# Altium schematic sheet 02_connector.SchDoc
size A3
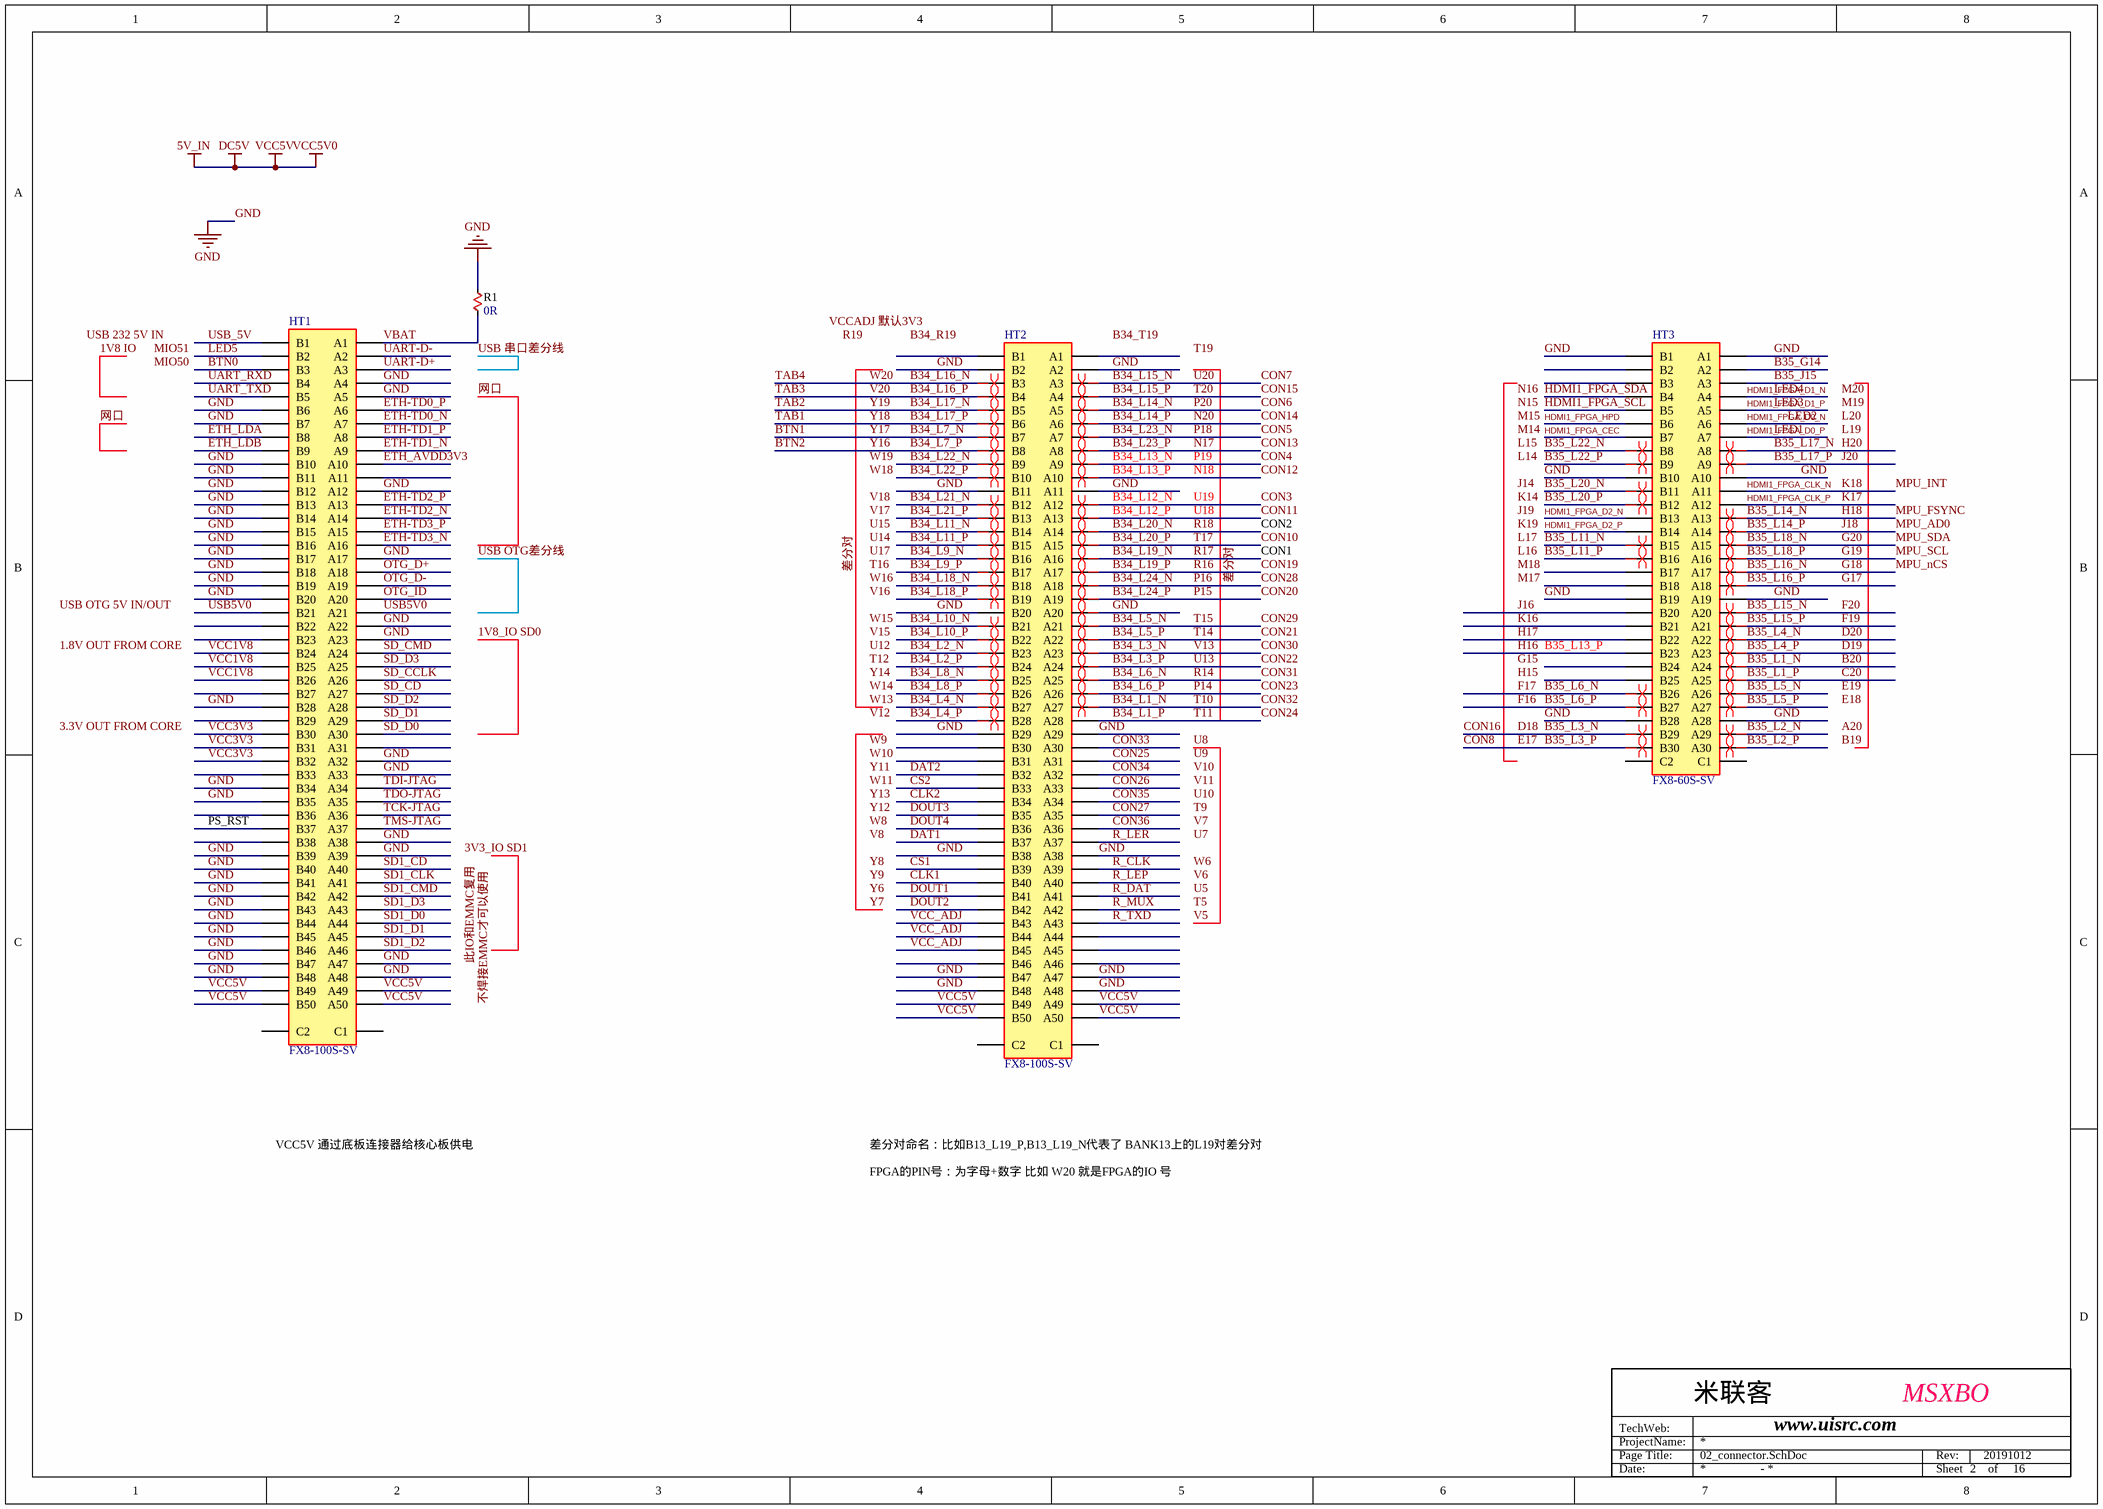
[diagram p0: 02_connector.SchDoc]

## Parts
HT1  FX8-100S-SV  [FX8-100S-SV92]
HT2  FX8-100S-SV  [FX8-100S-SV92]
HT3  FX8-60S-SV  [FX8-60S-SV92]
R1  0R  [R0603]

## Nets
GND: HT1.A4 HT1.A5 HT1.A12 HT1.A17 HT1.A22 HT1.A23 HT1.A32 HT1.A33 HT1.A38 HT1.A39 HT1.A47 HT1.A48 HT1.B6 HT1.B7 HT1.B10 HT1.B11 HT1.B12 HT1.B13 HT1.B14 HT1.B15 HT1.B16 HT1.B17 HT1.B18 HT1.B19 HT1.B20 HT1.B28 HT1.B34 HT1.B35 HT1.B39 HT1.B40 HT1.B41 HT1.B42 HT1.B43 HT1.B44 HT1.B45 HT1.B46 HT1.B47 HT1.B48 HT2.A2 HT2.A11 HT2.A20 HT2.A29 HT2.A38 HT2.A47 HT2.A48 HT2.B2 HT2.B11 HT2.B20 HT2.B29 HT2.B38 HT2.B47 HT2.B48 HT3.A1 HT3.A10 HT3.A19 HT3.A28 HT3.B1 HT3.B10 HT3.B19 HT3.B28 R1.1
VCC5V: HT1.A49 HT1.A50 HT1.B49 HT1.B50 HT2.A49 HT2.A50 HT2.B49 HT2.B50  [also labelled 5V_IN, DC5V, VCC5V0]
B20: HT3.A24  [also labelled B35_L1_N]
B34_L1_N: HT2.A27  [also labelled CON32, T10]
B34_L1_P: HT2.A28  [also labelled CON24, T11]
B34_L2_N: HT2.B23
B34_L2_P: HT2.B24
B34_L3_N: HT2.A23  [also labelled CON30, V13]
B34_L3_P: HT2.A24  [also labelled CON22, U13]
B34_L4_N: HT2.B27
B34_L4_P: HT2.B28
B34_L5_N: HT2.A21  [also labelled CON29, T15]
B34_L5_P: HT2.A22  [also labelled CON21, T14]
B34_L6_N: HT2.A25  [also labelled CON31, R14]
B34_L6_P: HT2.A26  [also labelled CON23, P14]
B34_L7_N: HT2.B7  [also labelled BTN1, Y17]
B34_L7_P: HT2.B8  [also labelled BTN2, Y16]
B34_L8_N: HT2.B25
B34_L8_P: HT2.B26
B34_L9_N: HT2.B16
B34_L9_P: HT2.B17
B34_L10_N: HT2.B21
B34_L10_P: HT2.B22
B34_L11_N: HT2.B14
B34_L11_P: HT2.B15
B34_L12_N: HT2.A12  [also labelled CON3, U19]
B34_L12_P: HT2.A13  [also labelled CON11, U18]
B34_L13_N: HT2.A9  [also labelled CON4, P19]
B34_L13_P: HT2.A10  [also labelled CON12, N18]
B34_L14_N: HT2.A5  [also labelled CON6, P20]
B34_L14_P: HT2.A6  [also labelled CON14, N20]
B34_L15_N: HT2.A3  [also labelled CON7, U20]
B34_L15_P: HT2.A4  [also labelled CON15, T20]
B34_L16_N: HT2.B3  [also labelled TAB4, W20]
B34_L16_P: HT2.B4  [also labelled TAB3, V20]
B34_L17_N: HT2.B5  [also labelled TAB2, Y19]
B34_L17_P: HT2.B6  [also labelled TAB1, Y18]
B34_L18_N: HT2.B18
B34_L18_P: HT2.B19
B34_L19_N: HT2.A16  [also labelled CON1, R17]
B34_L19_P: HT2.A17  [also labelled CON19, R16]
B34_L20_N: HT2.A14  [also labelled CON2, R18]
B34_L20_P: HT2.A15  [also labelled CON10, T17, 差分对]
B34_L21_N: HT2.B12
B34_L21_P: HT2.B13
B34_L22_N: HT2.B9
B34_L22_P: HT2.B10
B34_L23_N: HT2.A7  [also labelled CON5, P18]
B34_L23_P: HT2.A8  [also labelled CON13, N17]
B34_L24_N: HT2.A18  [also labelled CON28, P16]
B34_L24_P: HT2.A19  [also labelled CON20, P15]
B35_G14: HT3.A2
B35_J15: HT3.A3
B35_L1_P: HT3.A25  [also labelled C20]
B35_L2_N: HT3.A29
B35_L2_P: HT3.A30
B35_L3_N: HT3.B29  [also labelled CON16, D18]
B35_L3_P: HT3.B30  [also labelled CON8, E17]
B35_L4_N: HT3.A22  [also labelled D20]
B35_L4_P: HT3.A23  [also labelled D19]
B35_L5_N: HT3.A26
B35_L5_P: HT3.A27
B35_L6_N: HT3.B26  [also labelled F17]
B35_L6_P: HT3.B27  [also labelled F16]
B35_L11_N: HT3.B15
B35_L11_P: HT3.B16
B35_L13_P: HT3.B23  [also labelled H16]
B35_L14_N: HT3.A13  [also labelled H18, MPU_FSYNC]
B35_L14_P: HT3.A14  [also labelled J18, MPU_AD0]
B35_L15_N: HT3.A20  [also labelled F20]
B35_L15_P: HT3.A21  [also labelled F19]
B35_L16_N: HT3.A17  [also labelled G18, MPU_nCS]
B35_L16_P: HT3.A18  [also labelled G17]
B35_L17_N: HT3.A8  [also labelled H20]
B35_L17_P: HT3.A9  [also labelled J20]
B35_L18_N: HT3.A15  [also labelled G20, MPU_SDA]
B35_L18_P: HT3.A16  [also labelled G19, MPU_SCL]
B35_L20_N: HT3.B11
B35_L20_P: HT3.B12
B35_L22_N: HT3.B8
B35_L22_P: HT3.B9
BTN0: HT1.B3
CLK1: HT2.B40
CLK2: HT2.B34
CON25: HT2.A31
CON26: HT2.A33
CON27: HT2.A35
CON33: HT2.A30
CON34: HT2.A32
CON35: HT2.A34
CON36: HT2.A36
CS1: HT2.B39
CS2: HT2.B33
DAT1: HT2.B37
DAT2: HT2.B32
DOUT1: HT2.B41
DOUT2: HT2.B42
DOUT3: HT2.B35
DOUT4: HT2.B36
ETH-TD0_N: HT1.A7
ETH-TD0_P: HT1.A6
ETH-TD1_N: HT1.A9
ETH-TD1_P: HT1.A8
ETH-TD2_N: HT1.A14
ETH-TD2_P: HT1.A13
ETH-TD3_N: HT1.A16
ETH-TD3_P: HT1.A15
ETH_AVDD3V3: HT1.A10
ETH_LDA: HT1.B8
ETH_LDB: HT1.B9
H17: HT3.B22
HDMI1_FPGA_CEC: HT3.B7
HDMI1_FPGA_CLK_N: HT3.A11  [also labelled K18, MPU_INT]
HDMI1_FPGA_CLK_P: HT3.A12  [also labelled K17]
HDMI1_FPGA_D0_N: HT3.A6  [also labelled LED2]
HDMI1_FPGA_D0_P: HT3.A7  [also labelled LED1]
HDMI1_FPGA_D1_N: HT3.A4  [also labelled LED4]
HDMI1_FPGA_D1_P: HT3.A5  [also labelled LED3]
HDMI1_FPGA_D2_N: HT3.B13
HDMI1_FPGA_D2_P: HT3.B14
HDMI1_FPGA_HPD: HT3.B6
HDMI1_FPGA_SCL: HT3.B5
HDMI1_FPGA_SDA: HT3.B4
J16: HT3.B20
K16: HT3.B21
LED5: HT1.B2
OTG_D+: HT1.A18
OTG_D-: HT1.A19
OTG_ID: HT1.A20
PS_RST: HT1.B37
R_CLK: HT2.A39
R_DAT: HT2.A41
R_LEP: HT2.A40
R_LER: HT2.A37
R_MUX: HT2.A42
R_TXD: HT2.A43
SD1_CD: HT1.A40
SD1_CLK: HT1.A41
SD1_CMD: HT1.A42
SD1_D0: HT1.A44
SD1_D1: HT1.A45
SD1_D2: HT1.A46
SD1_D3: HT1.A43
SD_CCLK: HT1.A26
SD_CD: HT1.A27
SD_CMD: HT1.A24
SD_D0: HT1.A30
SD_D1: HT1.A29
SD_D2: HT1.A28
SD_D3: HT1.A25
TCK-JTAG: HT1.A36
TDI-JTAG: HT1.A34
TDO-JTAG: HT1.A35
TMS-JTAG: HT1.A37
UART-D+: HT1.A3
UART-D-: HT1.A2
UART_RXD: HT1.B4
UART_TXD: HT1.B5
USB5V0: HT1.A21 HT1.B21
USB_5V: HT1.B1
VBAT: HT1.A1 R1.2
VCC1V8: HT1.B24 HT1.B25 HT1.B26
VCC3V3: HT1.B30 HT1.B31 HT1.B32
VCC_ADJ: HT2.B43 HT2.B44 HT2.B45

Not connected (* = marked no-connect by the designer): HT1 A11 A31 B22 B23 B27 B29 B33 B36 B38 C1 C2; HT2 A1 A44 A45 A46 B1 B30 B31 B46 C1 C2; HT3 B2 B3 B17 B18 B24 B25 C1 C2

## Layout directives
differential pair: B20, B34_L1_N, B34_L2_N, B34_L2_P, B34_L3_N, B34_L3_P, B34_L4_N, B34_L4_P, B34_L5_N, B34_L5_P, B34_L6_N, B34_L6_P, B34_L7_N, B34_L7_P, B34_L8_N, B34_L8_P, B34_L9_N, B34_L9_P, B34_L10_N, B34_L10_P, B34_L11_N, B34_L11_P, B34_L12_N, B34_L12_P, B34_L13_N, B34_L13_P, B34_L14_N, B34_L14_P, B34_L15_N, B34_L15_P, B34_L16_N, B34_L16_P, B34_L17_N, B34_L17_P, B34_L18_N, B34_L18_P, B34_L19_N, B34_L19_P, B34_L20_N, B34_L20_P, B34_L21_N, B34_L21_P, B34_L22_N, B34_L22_P, B34_L23_N, B34_L23_P, B34_L24_N, B34_L24_P, B35_L1_P, B35_L2_N, B35_L2_P, B35_L3_N, B35_L3_P, B35_L4_N, B35_L4_P, B35_L5_N, B35_L5_P, B35_L6_N, B35_L6_P, B35_L11_N, B35_L11_P, B35_L14_N, B35_L14_P, B35_L15_N, B35_L15_P, B35_L16_N, B35_L16_P, B35_L17_N, B35_L17_P, B35_L18_N, B35_L18_P, B35_L20_N, B35_L20_P, B35_L22_N, B35_L22_P, GND

## Notes on the sheet
- VCC5V 通过底板连接器给核心板供电
- 差分对命名：比如B13_L19_P,B13_L19_N代表了 BANK13上的L19对差分对
- FPGA的PIN号：为字母+数字 比如 W20 就是FPGA的IO 号
- ProjectName:
- TechWeb:
- Page Title:
- 米联客
- www.uisrc.com
- MSXBO
- Rev:
- 20191012
- Date:
- -
- Sheet
- 2    of     16
- Labels drawn without touching a wire or pin: 1.8V OUT FROM CORE, 1V8 IO, 1V8_IO SD0, 3.3V OUT FROM CORE, 3V3_IO SD1, A20, B19, B34_R19, B34_T19, E18, E19, G15, H15, J14, J19, K14, K19, L14, L15, L16, L17, L19, L20, M14, M15, M17, M18, M19, M20, MIO50, MIO51, N15, N16, R19, T5, T9, T12, T16, T19, U5, U7, U8, U9, U10, U12, U14, U15, U17, USB 232 5V IN, USB OTG 5V IN/OUT, USB OTG差分线, USB 串口差分线, V5, V6, V7, V8, V10, V11, V12, V15, V16, V17, V18, VCCADJ 默认3V3, W6, W8, W9, W10, W11, W13, W14, W15, W16, W18, W19, Y6, Y7, Y8, Y9, Y11, Y12, Y13, Y14, 不焊接EMMC才可以使用, 差分对, 此IO和EMMC复用, 网口

## Library data of the parts
HT1 HT2 = FX8-100P-SV92
HT3 = FX8-60P-SV92
R1 = RESISTOR: Generic Resistor; Value: 390; Manufacturer: *; DPN: *